# EAGLE design Lift_M (EAGLE 7.6.0)
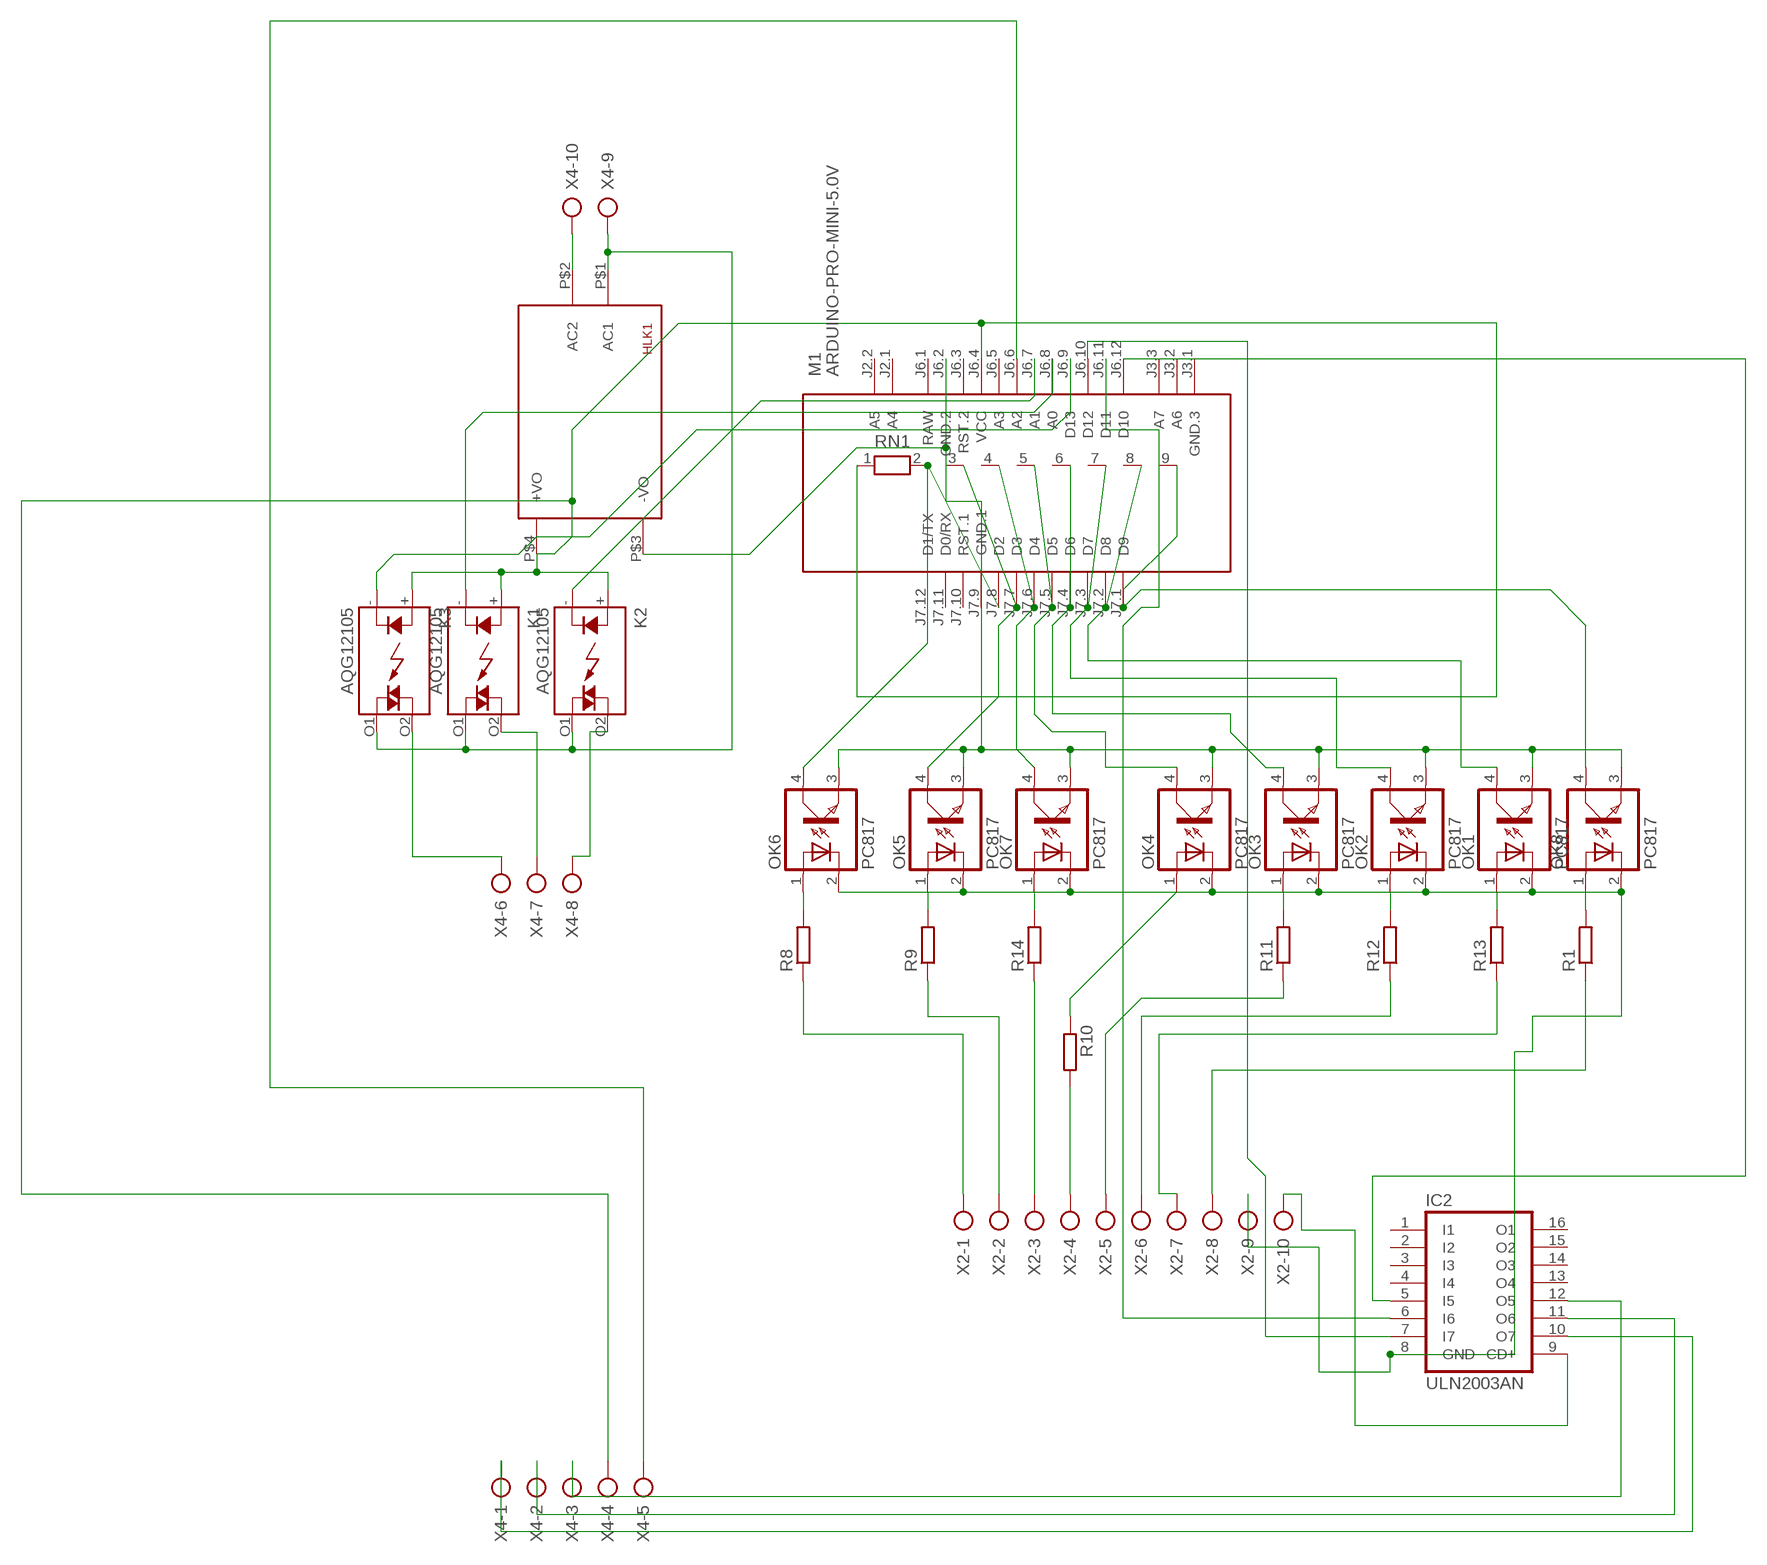
[diagram p0: schematic, sheet 1]

## Parts
HLK1  HLK-PM013W  [HLK-PM01]
IC2  ULN2003AN  [DIL16]
K1  AQG12105  [AQG]
K2  AQG12105  [AQG]
K3  AQG12105  [AQG]
M1  ARDUINO-PRO-MINI-5.0V  [ARDUINO-PRO-MINI]
OK1  PC817  [DIL04]
OK2  PC817  [DIL04]
OK3  PC817  [DIL04]
OK4  PC817  [DIL04]
OK5  PC817  [DIL04]
OK6  PC817  [DIL04]
OK7  PC817  [DIL04]
OK8  PC817  [DIL04]
R1  R-EU_0204/7  [0204/7]
R8  R-EU_0204/7  [0204/7]
R9  R-EU_0204/7  [0204/7]
R10  R-EU_0204/7  [0204/7]
R11  R-EU_0204/7  [0204/7]
R12  R-EU_0204/7  [0204/7]
R13  R-EU_0204/7  [0204/7]
R14  R-EU_0204/7  [0204/7]
RN1  RN08  [RN-9]
X2  AK300/10  [AK300/10]
X4  AK300/10  [AK300/10]

## Nets
5V: HLK1.P$4(+VO) K1.+(A) K2.+(A) K3.+(A) M1.J6.4(VCC) RN1.1 X4.4
12V: IC2.9(CD+) X2.10
GND1: HLK1.P$3(-VO) M1.J6.2(GND.2) M1.J7.9(GND.1) OK1.3(EMIT) OK2.3(EMIT) OK3.3(EMIT) OK4.3(EMIT) OK5.3(EMIT) OK6.3(EMIT) OK7.3(EMIT) OK8.3(EMIT)
GND12V: IC2.8(GND) OK1.2(C) OK2.2(C) OK3.2(C) OK4.2(C) OK5.2(C) OK6.2(C) OK7.2(C) OK8.2(C) X2.9
N$1: OK2.1(A) R12.2
N$2: OK1.1(A) R13.2
N$3: OK3.1(A) R11.2
N$4: R10.2 X2.4
N$5: OK7.1(A) R14.2
N$6: R14.1 X2.3
N$7: R1.1 X2.8
N$8: M1.J7.7(D3) OK5.4(COL) RN1.3
N$9: M1.J7.5(D5) OK4.4(COL) RN1.5
N$10: M1.J7.4(D6) OK3.4(COL) RN1.6
N$11: IC2.10(O7) X4.1
N$12: M1.J7.6(D4) OK7.4(COL) RN1.4
N$13: IC2.11(O6) X4.2
N$14: IC2.12(O5) X4.3
N$15: R8.1 X2.1
N$16: R9.1 X2.2
N$17: R11.1 X2.5
N$18: M1.J7.3(D7) OK2.4(COL) RN1.7
N$19: OK5.1(A) R9.2
N$20: R13.1 X2.7
N$21: OK8.1(A) R1.2
N$22: HLK1.P$2(AC2) X4.10
N$23: R12.1 X2.6
N$24: M1.J7.2(D8) OK1.4(COL) RN1.8
N$25: IC2.5(I5) M1.J6.12(D10)
N$26: HLK1.P$1(AC1) K1.O1(DS2) K2.O1(DS2) K3.O1(DS2) X4.9
N$27: K3.O2(DS1) X4.6
N$28: K1.O2(DS1) X4.7
N$29: K2.O2(DS1) X4.8
N$30: M1.J7.1(D9) OK8.4(COL) RN1.9
N$32: M1.J7.8(D2) OK6.4(COL) RN1.2
N$33: OK6.1(A) R8.2
N$34: OK4.1(A) R10.1
N$35: IC2.7(I7) M1.J6.10(D12)
N$36: IC2.6(I6) M1.J6.11(D11)
N$38: M1.J6.6(A2) X4.5
N$39: K3.-(K) M1.J6.9(D13)
N$40: K1.-(K) M1.J6.8(A0)
N$41: K2.-(K) M1.J6.7(A1)
Unconnected: IC2.1(I1) IC2.2(I2) IC2.3(I3) IC2.4(I4) IC2.13(O4) IC2.14(O3) IC2.15(O2) IC2.16(O1) M1.J2.1(A4) M1.J2.2(A5) M1.J3.1(GND.3) M1.J3.2(A6) M1.J3.3(A7) M1.J6.3(RST.2) M1.J6.5(A3) M1.J7.10(RST.1) M1.J7.11(D0/RX) M1.J7.12(D1/TX)

## Power pins joined to a net without a drawn wire
RAW: M1.J6.1(RAW)

## Library data of the parts
HLK1 = HLK-PM01:HLK-PM01: Hi-Link Power Supply HLK-PM01 3W Author: Ahmed Said <https://github.com/AhmedSaid/EAGLELibraries>
IC2 = uln-udn:ULN2003A: DRIVER ARRAY
K1-K3 = relay:AQG*: SOLID STATE RELAY NAiS Zero-cross, Non zero-cross Source: http://www.mew-europe.com/.. en_ds_61611_0000.pdf; MF: AROMAT/ MATSUSHITA; MPN: AQG12105; OC_FARNELL: unknown; OC_NEWARK: 20J4759
M1 = diy-modules:ARDUINO-PRO-MINI-*: Arduino Pro Mini and compatible devices More details available here: https://www.arduino.cc/en/Main/ArduinoBoardProMini Click here to find device on ebay.com <http://www.ebay.com/sch/arduino+pro+mini>
OK1-OK8 = optocoupler:PC817: SHARP OPTO COUPLER; MPN: PC817X4J000F; OC_FARNELL: 9707727; OC_NEWARK: 97K7059
R1 R8-R14 = rcl:R-EU_: RESISTOR, European symbol
RN1 = resistor-net:RN08: RESISTOR NETWORK; OC_FARNELL: unknown; OC_NEWARK: unknown
X2 X4 = con-ptr500:AK300/10: CONNECTOR; OC_FARNELL: unknown; OC_NEWARK: unknown

## Board
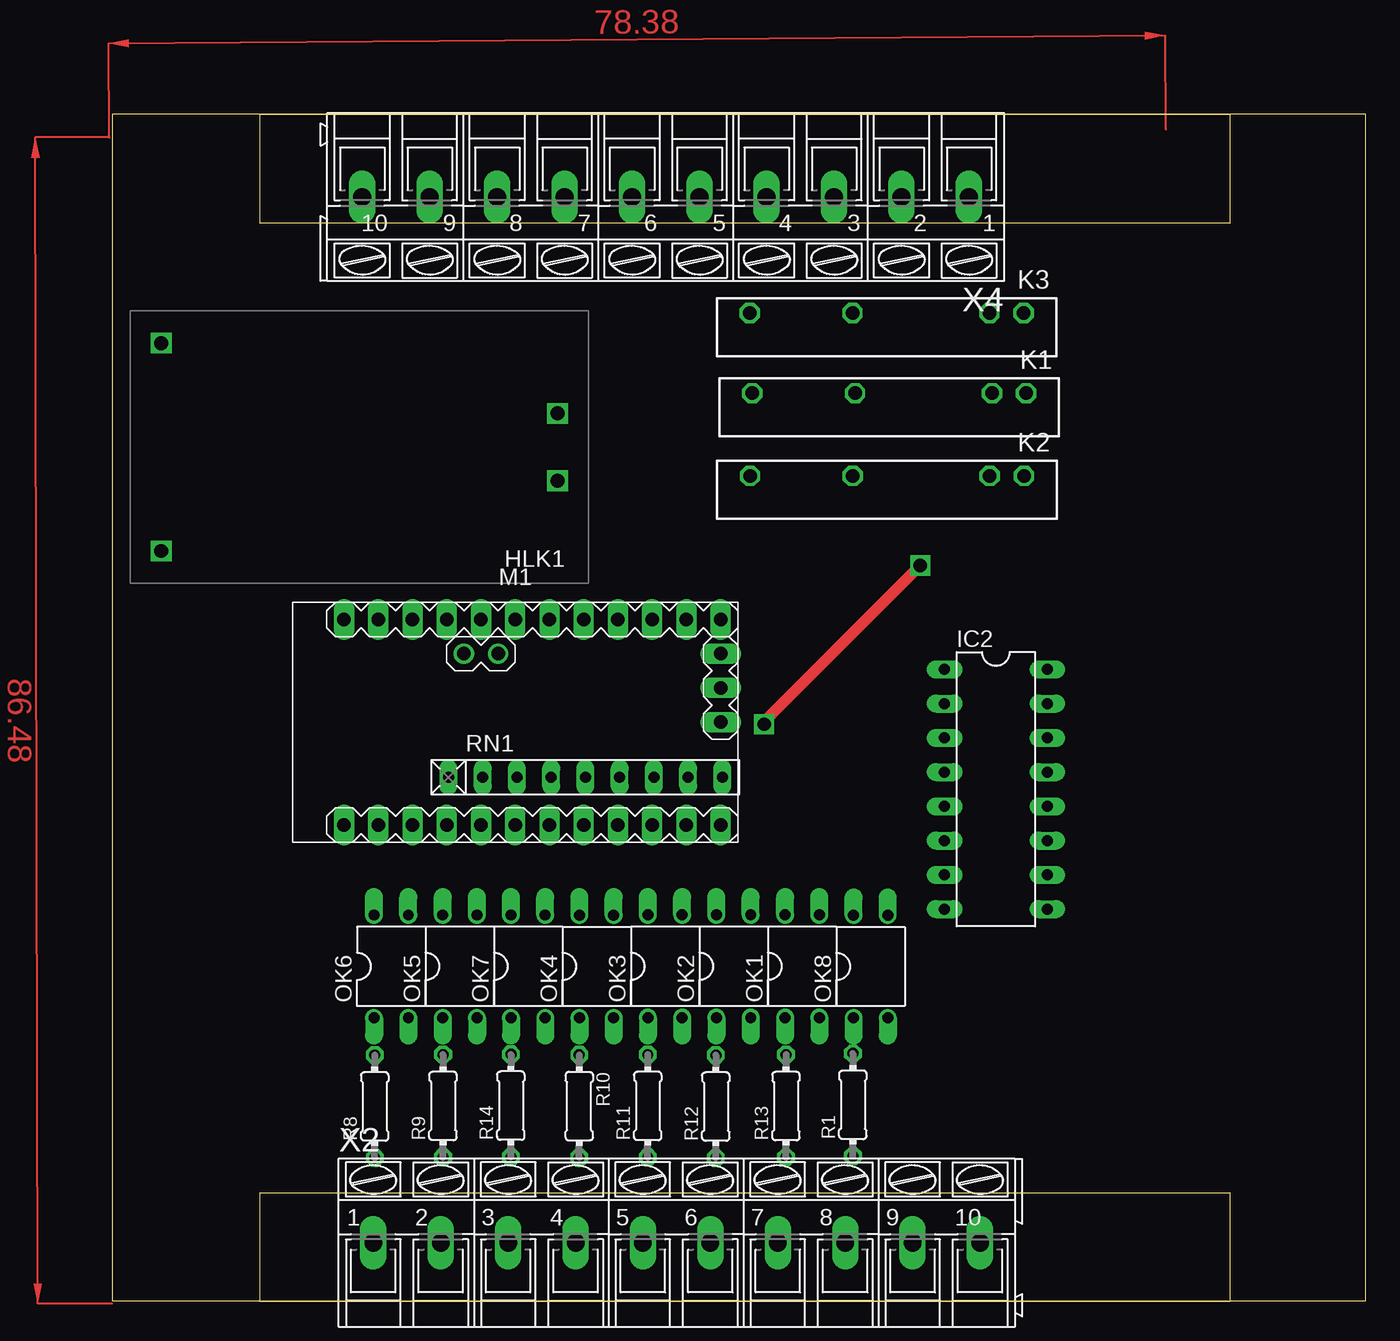
[diagram p1: board, top side]
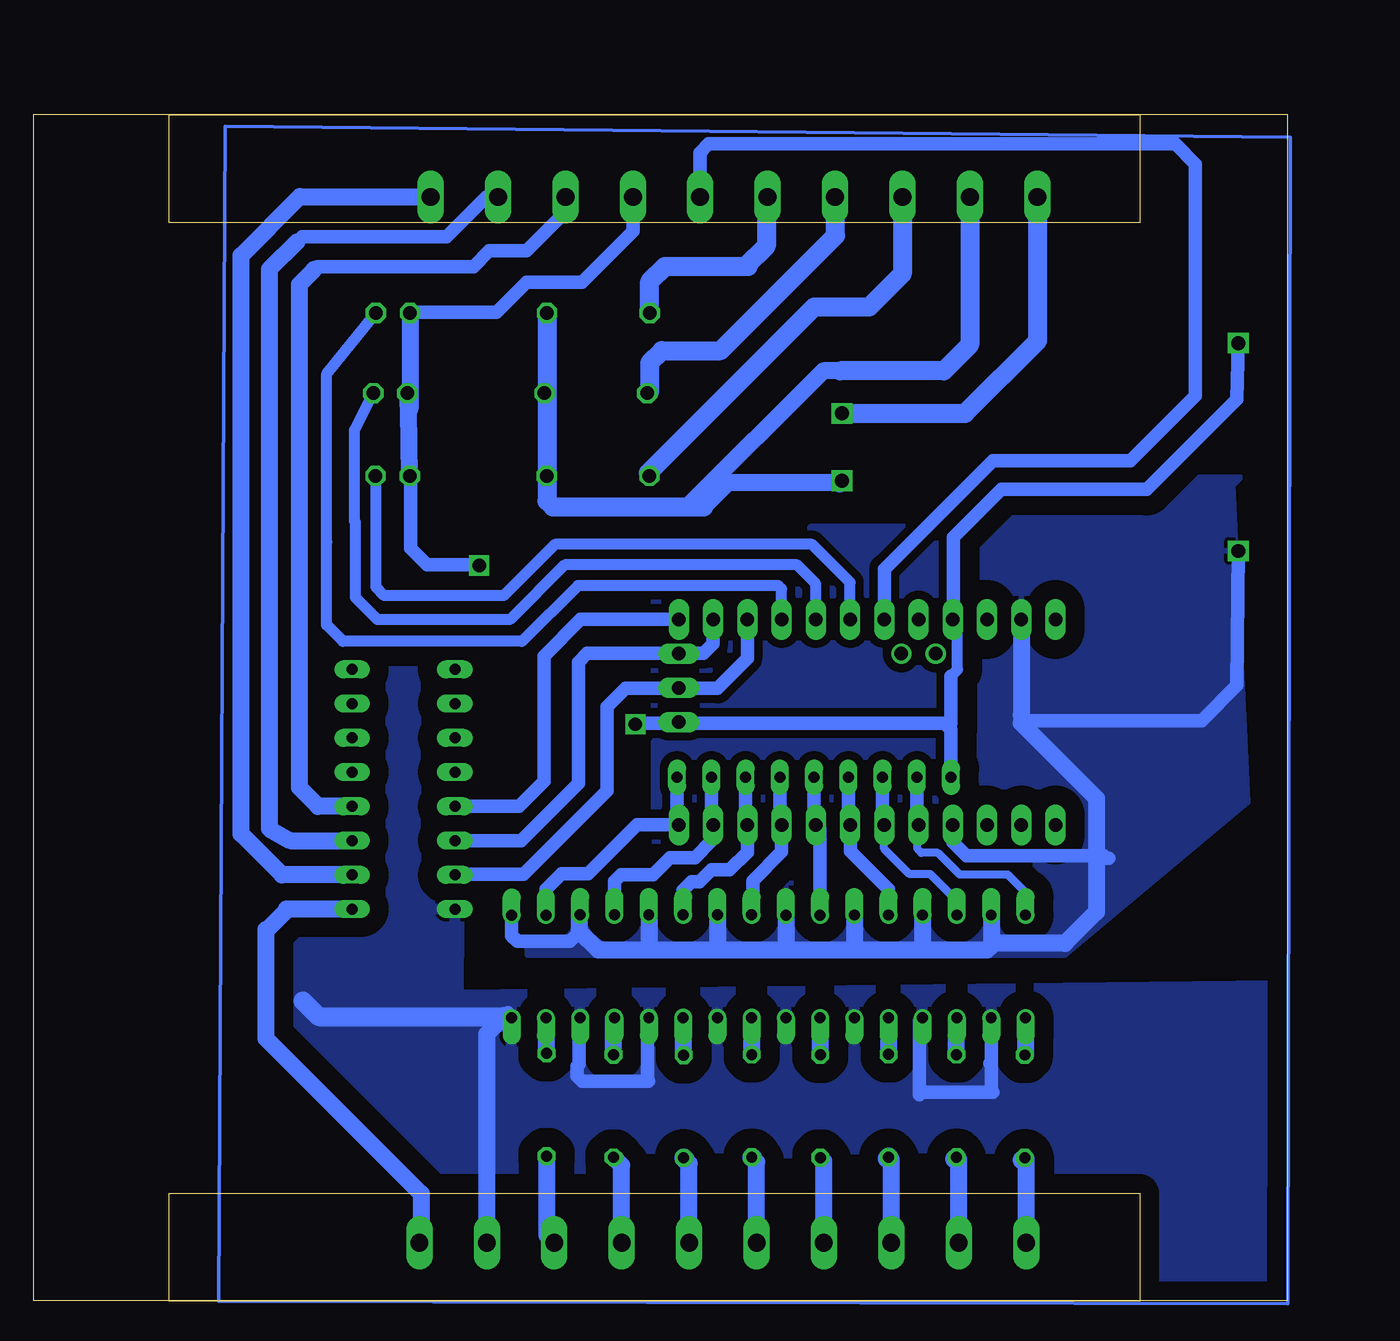
[diagram p2: board, bottom side, seen from below]

Size 93 x 88.03 mm. Coordinates in mm from the lower left corner, seen from the top.
Outline: 0,0.03 93,0.03 93,88.03 0,88.03 0,0.03
Copper layers (1*16): Top 0.035mm / dielectric 1.5mm / Bottom 0.035mm
Design rules "default": minimum track width 10mil, minimum drill 24mil, track to track 8mil, track to pad 8mil, pad to pad 8mil, via to via 8mil, smd to smd 8mil, copper to edge 40mil, drill to drill 8mil, minimum pad ring 10mil, minimum via ring 8mil, stop-mask expansion 4mil, vias tented up to drill 0mil, thermal gap 10mil

### Footprints (pad centres in the part's own frame; a part is rotated, then mirrored left to right if it is on the bottom)
HLK-PM01 = drill 1.016 square: P$1 -14.7,2.5; P$2 -14.7,-2.5; P$3 14.7,7.7; P$4 14.7,-7.7
DIL16 = drill 0.813 long: 1 -8.89,-3.81; 2 -6.35,-3.81; 3 -3.81,-3.81; 4 -1.27,-3.81; 5 1.27,-3.81; 6 3.81,-3.81; 7 6.35,-3.81; 8 8.89,-3.81; 9 8.89,3.81; 10 6.35,3.81; 11 3.81,3.81; 12 1.27,3.81; 13 -1.27,3.81; 14 -3.81,3.81; 15 -6.35,3.81; 16 -8.89,3.81
AQG = drill 1 octagon: + -7.62,0; - -10.16,0; O1 2.54,0; O2 10.16,0
ARDUINO-PRO-MINI = drill 1: J2.1 -1.27,5.08; J2.2 -3.81,5.08 | drill 1 long: J3.1 15.24,0; J3.2 15.24,2.54; J3.3 15.24,5.08; J6.1 -12.7,7.62; J6.2 -10.16,7.62; J6.3 -7.62,7.62; J6.4 -5.08,7.62; J6.5 -2.54,7.62; J6.6 0,7.62; J6.7 2.54,7.62; J6.8 5.08,7.62; J6.9 7.62,7.62; J6.10 10.16,7.62; J6.11 12.7,7.62; J6.12 15.24,7.62; J7.1 15.24,-7.62; J7.2 12.7,-7.62; J7.3 10.16,-7.62; J7.4 7.62,-7.62; J7.5 5.08,-7.62; J7.6 2.54,-7.62; J7.7 0,-7.62; J7.8 -2.54,-7.62; J7.9 -5.08,-7.62; J7.10 -7.62,-7.62; J7.11 -10.16,-7.62; J7.12 -12.7,-7.62
DIL04 = drill 0.813 offset: 1 -1.27,-3.81; 2 1.27,-3.81; 3 1.27,3.81; 4 -1.27,3.81
0204/7 = drill 0.813 octagon: 1 -3.81,0; 2 3.81,0
RN-9 = drill 0.813 long: 1 -10.16,0; 2 -7.62,0; 3 -5.08,0; 4 -2.54,0; 5 0,0; 6 2.54,0; 7 5.08,0; 8 7.62,0; 9 10.16,0
AK300/10 = drill 1.321 long: 1 -22.504,0; 2 -17.501,0; 3 -12.497,0; 4 -7.493,0; 5 -2.515,0; 6 2.489,0; 7 7.493,0; 8 12.497,0; 9 17.501,0; 10 22.504,0

### Placement (x,y rotation side)
HLK1  18.35,63.34 180 top
IC2  65.57,37.97 270 top
K1  57.65,67.33 180 top
K2  57.48,61.21 180 top
K3  57.47,73.28 180 top
M1  29.91,42.94 0 top
OK1  51.19,24.84 0 top
OK2  46.11,24.84 0 top
OK3  41.02,24.83 0 top
OK4  35.95,24.83 0 top
OK5  25.79,24.83 0 top
OK6  20.71,24.83 0 top
OK7  30.87,24.83 0 top
OK8  56.27,24.82 0 top
R1  54.95,14.57 90 top
R8  19.49,14.45 90 top
R9  24.55,14.48 90 top
R10  34.66,14.46 270 top
R11  39.74,14.48 90 top
R12  44.79,14.44 90 top
R13  49.99,14.48 90 top
R14  29.58,14.5 90 top
RN1  35.11,38.85 0 top
X2  41.89,4.34 0 top
X4  41.06,81.88 180 top

### Tracks (layer width: path | path; a pad name or v marks a point on that pad's centre or on a via)
5V  (via drill 1)
  Top 0.813: v48.37,42.79 48.37,42.97 v59.95,54.56
  Top 1.016: v48.37,42.79 48.23,42.79
  Bottom 0.61: 24.47,50.2 M1.J6.4
  Bottom 0.813: 24.95,46.36 24.47,46.84 24.47,50.2 | v59.95,54.56 60.07,54.56 60.12,54.62
  Bottom 1.016: HLK1.P$4 3.74,66.9 10.44,60.2 21.23,60.2 24.79,56.64 24.79,50.6 M1.J6.4 | RN1.1 24.95,42.39 25.18,42.61 | 25.18,42.61 25.42,42.85 48.3,42.85 v48.37,42.79 | 60.12,54.62 63.8,54.62 65.03,55.84 65.03,61.14 K2.+ | 24.95,46.36 24.95,42.84 25.18,42.61 | X4.4 48.55,79.33 52.33,75.56 56.45,75.56 58.68,73.33 65.03,73.33 K3.+
  Bottom 1.27: K3.+ 65.09,66.16 K1.+ 65.2,66.05 K2.+
12V
  Bottom 1.27: IC2.9 74.17,29.07 | 74.17,29.07 74.26,29.07 | 74.17,29.07 75.69,27.56 75.78,27.56 75.78,19.5 64.26,7.98 64.26,4.47 X2.10
GND1
  Bottom 0.61: 14.37,32.94 14.17,33.14
  Bottom 1.016: HLK1.P$3 3.74,45.68 6.37,43.05 19.34,43.05 19.75,43.46 | OK8.3 57.54,27.12 57.11,26.69 53.23,26.69 52.5,27.42 | M1.J7.9 24.83,34.04 23.81,33.02 13.61,33.02 13.44,32.86 | 13.44,32.86 13.26,32.86 | 13.44,32.86 14.13,32.86 14.17,32.81
  Bottom 1.27: OK6.3 21.98,26.34 | 21.98,26.34 22.29,26.03 26.85,26.03 | 26.85,26.03 32.04,26.03 | 32.04,26.03 37.31,26.03 | 37.31,26.03 42.3,26.03 | 42.3,26.03 47.41,26.03 | 47.41,26.03 51.12,26.03 52.5,27.42 52.5,28.6 OK1.3 | OK2.3 47.38,26.07 47.41,26.03 | OK3.3 42.29,26.04 42.3,26.03 | OK4.3 37.21,26.13 37.31,26.03 | OK7.3 32.14,26.13 32.04,26.03 | OK5.3 27.06,26.25 26.85,26.03 | M1.J6.2 19.75,43.46 19.75,42.87 14.17,37.3 14.17,33.14 14.17,32.81 14.17,28.87 16.5,26.54 21.78,26.54 21.98,26.34
  pour Bottom (isolate 1.422): 3.46,61.08 25.58,61.08 41.96,52.76 56.3,52.79 56.73,32.61 56.36,25.66 16.49,25.66 2.96,37 4.05,60.49
GND12V
  Bottom 0.813: 47.4,20.31 47.46,20.37
  Bottom 1.016: 22.09,17.66 21.98,17.77 OK6.2 21.98,15.64 21.84,15.5 27.12,15.5 27.3,15.32 27.3,20.79 OK5.2 | OK1.2 52.53,21.1 52.53,17.59 52.7,17.41 52.7,16.68 52.34,16.31 47.41,16.31 47.46,16.36 47.46,20.37 47.46,20.95 OK2.2 | 57.81,21.41 58.12,21.1
  Bottom 1.27: X2.9 59.39,19.83 58.12,21.1
  Bottom 1.422: 73.04,22.27 71.86,21.1 58.12,21.1
  pour Bottom (isolate 1.422): 0.62,23.44 0.16,1.21 59.78,0.51 76.92,0.51 76.61,1.7 76.71,18.41 77.32,20.53 77.5,22.92 77.08,50.19 61.35,49.89 61.53,22.72
N$1
  Bottom 1.27: R12.2 44.79,20.98 OK2.1
N$2
  Bottom 1.27: R13.2 49.99,20.95 OK1.1
N$3
  Bottom 1.27: OK3.1 R11.2
N$4
  Bottom 1.27: X2.4 34.39,10.39 R10.2
N$5
  Bottom 1.27: OK7.1 29.6,18.32 R14.2
N$6
  Bottom 1.27: 29.44,10.55 R14.1 29.39,10.5 X2.3
  Bottom 1.422: 29.67,10.6 R14.1
N$7
  Bottom 1.27: R1.1 54.95,4.91 X2.8
N$8
  Bottom 0.61: OK5.4 24.52,29.7 26.5,31.67 28.03,31.67 29.93,33.57 29.93,35.29 M1.J7.7
  Bottom 1.016: RN1.3 30.03,35.44 M1.J7.7
N$9
  Bottom 1.016: OK4.4 34.67,35.01 M1.J7.5 35.11,35.44 RN1.5
N$10
  Bottom 1.016: RN1.6 37.65,35.44 M1.J7.4 37.53,33.32 39.66,31.19 39.66,28.73 OK3.4
N$11
  Bottom 1.27: IC2.10 74.58,31.61 77.63,34.66 77.63,77.53 73.26,81.9 63.59,81.9 X4.1
N$12
  Bottom 1.016: RN1.4 32.57,35.44 M1.J7.6 32.41,35.28 32.41,33.38 29.6,30.56 OK7.4
N$13
  Bottom 1.016: X4.2 59.46,81.88 62.39,78.95 73.08,78.95 73.47,78.56
  Bottom 1.27: IC2.11 73.97,34.16 75.52,35.04 75.52,76.51 73.47,78.56
N$14
  Bottom 1.016: X4.3 53.56,80.79 56.46,77.89 59.21,77.89 60.38,76.72 71.98,76.72 72.21,76.49
  Bottom 1.27: IC2.12 71.9,36.7 73.31,38.1 73.31,75.39 72.21,76.49
N$15
  Bottom 1.27: 19.44,10.58 R8.1 19.38,10.53 X2.1
  Bottom 1.422: 19.67,10.46 R8.1
N$16
  Bottom 1.27: X2.2 24.39,10.51 R9.1
  Bottom 1.422: 24.67,10.55 R9.1
N$17
  Bottom 1.27: 39.45,10.39 R11.1 39.37,10.31 X2.5
  Bottom 1.422: 39.68,10.62 R11.1
N$18
  Bottom 1.016: RN1.7 40.19,35.44 M1.J7.3 40.07,33.31 41.39,31.99 42.71,31.99 43.6,31.1 44.21,31.1 44.83,30.47 OK2.4
N$19
  Bottom 1.27: R9.2 24.55,20.99 OK5.1
N$20
  Bottom 1.27: X2.7 49.38,10.06 R13.1
N$21
  Bottom 1.27: OK8.1 55,18.42 R1.2
N$22
  Bottom 1.422: HLK1.P$2 23.91,65.84 18.53,71.22 18.53,81.85 X4.10
N$23
  Bottom 1.27: X2.6 44.38,10.22 R12.1
  Bottom 1.422: 44.69,10.53 R12.1
N$24
  Bottom 1.016: RN1.8 42.73,35.44 M1.J7.2 42.71,35.22 42.71,34.14 43.96,32.89 45.8,32.89 47.05,31.64 49.42,31.64 49.92,31.14 OK1.4
N$25
  Bottom 1.016: M1.J6.12 52.44,50.56 55.16,47.84 55.16,38.56 57.01,36.7 IC2.5
N$26
  Bottom 1.27: 33.19,68.99 34.44,68.99 44.52,58.91 | 33.2,60.69 41.5,60.69 43.28,58.91
  Bottom 1.422: X4.9 23.56,70.93 25.5,68.99 33.19,68.99 | 33.2,60.69 HLK1.P$1 | K3.O1 54.93,67.52 | 54.93,67.52 K1.O1 | 54.93,67.52 54.93,61.22 | 54.93,61.22 K2.O1 | 54.93,61.22 54.93,59.34 54.49,58.91 44.52,58.91 43.28,58.91
N$27
  Bottom 1.422: X4.6 38.66,81.8 38.66,78.25 40.16,76.74 | K3.O2 47.31,75.62 46.18,76.74 40.16,76.74 | 40.16,76.74 39.99,76.74
N$28
  Bottom 1.422: X4.7 33.53,81.84 33.53,79.03 42.05,70.5 46.41,70.5 47.32,69.59 47.32,67.51 K1.O2
N$29
  Bottom 0.813: K2.O2 47.32,61.35 47.4,61.42
  Bottom 1.422: X4.8 28.56,76.19 31.02,73.73 35.09,73.73 47.4,61.42
N$30
  Bottom 1.016: RN1.9 45.27,35.44 M1.J7.1 48.26,35.32 51.88,31.7 53.84,31.7 55,30.54 OK8.4
N$32
  Bottom 0.61: OK6.4 19.44,30.32 20.75,31.63 24.31,31.63 25.94,33.26 27.17,33.26 27.44,33.53 27.44,35.24 M1.J7.8
  Bottom 1.016: RN1.2 27.49,35.44 M1.J7.8
N$33
  Bottom 1.27: OK6.1 19.44,18.31 R8.2
N$34
  Bottom 1.27: R10.1 34.66,21 OK4.1
N$35
  Bottom 1.016: M1.J6.10 40.07,47.66 42.28,45.46 49.1,45.46 50.47,44.09 50.47,37.85 56.67,31.65 61.72,31.65 IC2.7
N$36
  Bottom 1.016: M1.J6.11 42.61,48.75 43.32,48.04 51.95,48.04 52.6,47.38 52.6,38.4 56.85,34.16 IC2.6
N$38
  Bottom 1.016: X4.5 43.58,85.17 42.94,85.81 8.33,85.81 6.83,84.31 6.83,67.14 11.65,62.33 21.87,62.33 29.91,54.29 M1.J6.6
N$39
  Bottom 0.813: K3.- 71.27,68.79 71.27,56.29 71.29,56.26 71.29,50.16 70.05,48.93 56.78,48.93 52.64,53.07 37.77,53.07 37.53,52.82 M1.J6.9
N$40
  Bottom 0.813: K1.- 69.2,64.59 69.2,57.86 69.12,57.78 69.12,52.18 67.5,50.55 57.67,50.55 53.62,54.6 36.38,54.6 34.99,53.2 M1.J6.8
N$41
  Bottom 0.813: M1.J6.7 32.45,53.31 35.27,56.13 54.33,56.13 58.13,52.33 66.99,52.33 67.61,52.95 67.61,61.18 K2.- 67.63,61.2
NS$$
  pour Bottom (isolate 0.61): 25.78,59.04 25.78,34.61 26.35,34.04 47.04,34.11 47.03,36.23 47.03,53.09 46.52,53.52 38.93,53.86 35.31,57.48 27.34,57.48 25.79,59.03
S$1
  Bottom 0.254: -0.2,86.31 -0.02,-0.17 79.28,0 78.81,87.14 -0.2,86.3
(copper drawn outside any net)
  shapes: Top area x2